# Altium schematic sheet BMS-S04-V00-Microcontroller.SchDoc: Microcontroller
size A3; DrawnBy: Zoe Goodward; DocumentNumber: 2; Revision: 01; SheetNumber: 2; SheetTotal: 10; Version: 01; Project: Battery Managment System 2020; PageSetup: Record=PageOptions|CenterHorizontal=True|CenterVertical=True|PrintScale=0.97|XCorrection=1.00|YCorrection=1.00|PrintKind=0|BorderSize=5000000|LeftOffset=0|BottomOffset=0|Orientation=2|PaperLength=1000|PaperWidth=1000|Scale=100|PaperSource=7|PrintQuality=-4|MediaType=1|DitherType=10|PaperKind=A4|PrintScaleMode=1
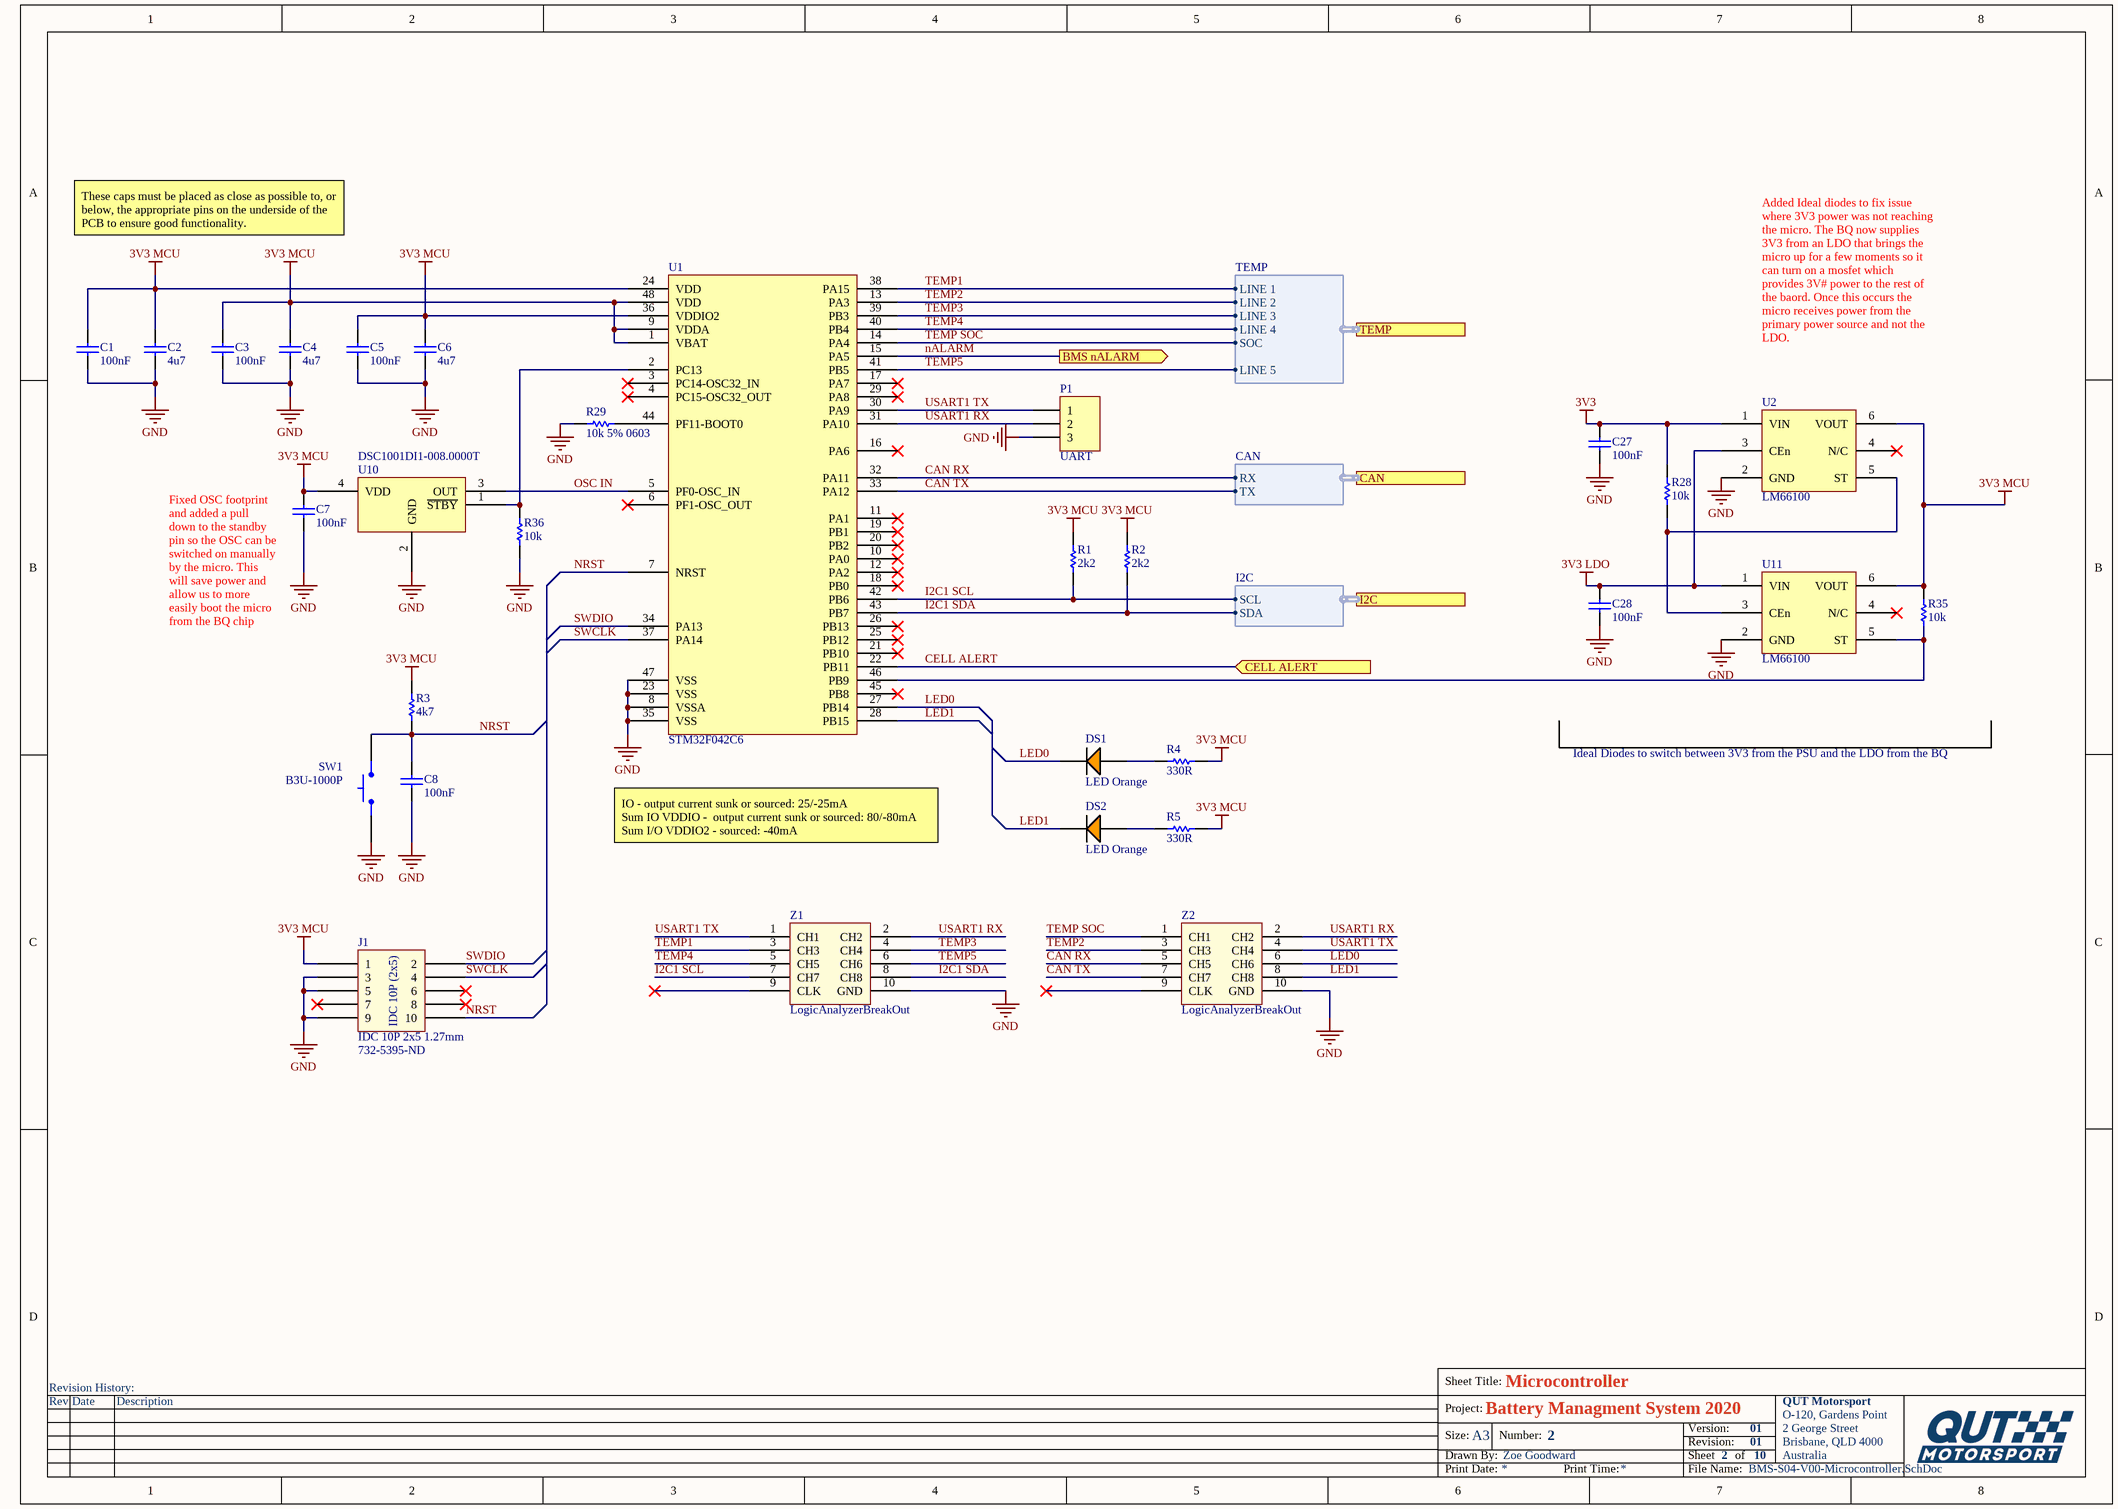
[diagram p0: BMS-S04-V00-Microcontroller.SchDoc]

## Parts
C1  100nF  [Cap_Ceramic_0603]
C2  4u7  [Cap_Ceramic_0603]
C3  100nF  [Cap_Ceramic_0603]
C4  4u7  [Cap_Ceramic_0603]
C5  100nF  [Cap_Ceramic_0603]
C6  4u7  [Cap_Ceramic_0603]
C7  100nF  [Cap_Ceramic_0603]
C8  100nF  [Cap_Ceramic_0603]
C27  100nF  [Cap_Ceramic_0603]
C28  100nF  [Cap_Ceramic_0603]
DS1  LED Orange  [LED ORANGE 0603]
DS2  LED Orange  [LED ORANGE 0603]
J1  IDC 10P 2x5 1.27mm  [IDC 1.27MM 10P]
P1  UART  [HDR1X3]
R1  2k2  [Res_ThinFilm_0603]
R2  2k2  [Res_ThinFilm_0603]
R3  4k7  [Res_ThinFilm_0603]
R4  330R  [Res_ThinFilm_0603]
R5  330R  [Res_ThinFilm_0603]
R28  10k  [Res_ThinFilm_0603]
R29  10k 5% 0603  [Res_ThinFilm_0603]
R35  10k  [Res_ThinFilm_0603]
R36  10k  [Res_ThinFilm_0603]
SW1  B3U-1000P  [BTN B3U-1000P]
U1  STM32F042C6  [STM32F042C6]
U2  LM66100  [LM66100]
U10  DSC1001DI1-008.0000T  [DSC1001DI1-008.0000TCT-ND]
U11  LM66100  [LM66100]
Z1  LogicAnalyzerBreakOut  [LogicAnalyzer]
Z2  LogicAnalyzerBreakOut  [LogicAnalyzer]

## Ports
BMS nALARM (out), CAN (harness CAN), CELL ALERT (in), I2C (harness I2C), TEMP (harness TEMP)

## Harnesses
CAN: RX, TX
TEMP: LINE 1, LINE 2, LINE 3, LINE 4, LINE 5, SOC
I2C: SCL, SDA

## Nets
3V3: C27.2 R28.2 U2.1(VIN)
3V3 LDO: C28.2 U2.3(CEn) U11.1(VIN)
3V3 MCU: C1.2 C2.2 C3.2 C4.2 C5.2 C6.2 C7.2 J1.1 R1.2 R2.2 R3.2 R4.2 R5.2 R35.2 U1.1(VBAT) U1.9(VDDA) U1.24(VDD) U1.36(VDDIO2) U1.48(VDD) U2.6(VOUT) U10.4(VDD) U11.6(VOUT)
GND: C1.1 C2.1 C3.1 C4.1 C5.1 C6.1 C7.1 C8.1 C27.1 C28.1 J1.3 J1.5 J1.9 P1.3 R29.1 R36.1 SW1.1 U1.8(VSSA) U1.23(VSS) U1.35(VSS) U1.47(VSS) U2.2(GND) U10.2(GND) U11.2(GND) Z1.10(GND) Z2.10(GND)
CAN RX: U1.32(PA11) Z2.5(CH5) ; port CAN.RX
CAN TX: U1.33(PA12) Z2.7(CH7) ; port CAN.TX
CELL ALERT: U1.22(PB11) ; port CELL ALERT
I2C1 SCL: R1.1 U1.42(PB6) Z1.7(CH7) ; port I2C.SCL
I2C1 SDA: R2.1 U1.43(PB7) Z1.8(CH8) ; port I2C.SDA
LED0: DS1.2(C) U1.27(PB14) Z2.6(CH6)
LED1: DS2.2(C) U1.28(PB15) Z2.8(CH8)
nALARM: U1.15(PA5) ; port BMS nALARM
NRST: C8.2 J1.10 R3.1 SW1.2 U1.7(NRST)
OSC IN: U1.5(PF0-OSC_IN) U10.3(OUT)
SWCLK: J1.4 U1.37(PA14)
SWDIO: J1.2 U1.34(PA13)
TEMP1: U1.38(PA15) Z1.3(CH3) ; port TEMP.LINE 1
TEMP2: U1.13(PA3) Z2.3(CH3) ; port TEMP.LINE 2
TEMP3: U1.39(PB3) Z1.4(CH4) ; port TEMP.LINE 3
TEMP4: U1.40(PB4) Z1.5(CH5) ; port TEMP.LINE 4
TEMP5: U1.41(PB5) Z1.6(CH6) ; port TEMP.LINE 5
TEMP SOC: U1.14(PA4) Z2.1(CH1) ; port TEMP.SOC
USART1 RX: P1.2 U1.31(PA10) Z1.2(CH2) Z2.2(CH2)
USART1 TX: P1.1 U1.30(PA9) Z1.1(CH1) Z2.4(CH4)
NetDS1_1: DS1.1(A) R4.1
NetDS2_1: DS2.1(A) R5.1
NetR28_1: R28.1 U2.5(ST) U11.3(CEn)
NetR29_2: R29.2 U1.44(PF11-BOOT0)
NetR35_1: R35.1 U1.46(PB9) U11.5(ST)
NetR36_2: R36.2 U1.2(PC13) U10.1(~{STBY})

Not connected (* = marked no-connect by the designer): J1 6* 7* 8*; U1 3(PC14-OSC32_IN)* 4(PC15-OSC32_OUT)* 6(PF1-OSC_OUT)* 10(PA0)* 11(PA1)* 12(PA2)* 16(PA6)* 17(PA7)* 18(PB0)* 19(PB1)* 20(PB2)* 21(PB10)* 25(PB12)* 26(PB13)* 29(PA8)* 45(PB8)*; U2 4(N/C)*; U11 4(N/C)*; Z1 9(CLK)*; Z2 9(CLK)*

## Notes on the sheet
- These caps must be placed as close as possible to, or below, the appropriate pins on the underside of the PCB to ensure good functionality.
- Added Ideal diodes to fix issue where 3V3 power was not reaching the micro. The BQ now supplies 3V3 from an LDO that brings the micro up for a few moments so it can turn on a mosfet which provides 3V# power to the rest of the baord. Once this occurs the micro receives power from the primary power source and not the LDO.
- (near C7) Fixed OSC footprint and added a pull down to the standby pin so the OSC can be switched on manually by the micro. This will save power and allow us to more easily boot the micro from the BQ chip
- Ideal Diodes to switch between 3V3 from the PSU and the LDO from the BQ
- IO - output current sunk or sourced: 25/-25mA
  Sum IO VDDIO -  output current sunk or sourced: 80/-80mA
  Sum I/O VDDIO2 - sourced: -40mA
- (near J1) 732-5395-ND
- Revision History:
- Sheet Title:
- Rev
- Date
- Description
- Project:
- Size:
- Drawn By:
- A3
- Number:
- Revision:
- Sheet
- Version:
- of
- QUT Motorsport
- O-120, Gardens Point
- 2 George Street
- Brisbane, QLD 4000
- Australia
- Print Date:
- Print Time:
- File Name:
- (in symbol IDC 10P 2x5 1.27mm) IDC 10P (2x5)

## Library data of the parts
C1 C3 C5 C7 C8 C27 C28 = 100nF 50V 5% X7R 0603: Capacitor, Ceramic, SMD, 100nF, 50V, 5%, X7R, 0603
C2 C4 C6 = 4u7 50V 5% X7R 0603: Capacitor, Ceramic, SMD, 4u7, 50V, 5%, X7R, 0603
DS1 DS2 = LED ORANGE 0603
P1 = Header 3: Header, 3-Pin; LatestRevisionDate: 17-Jul-2002; LatestRevisionNote: Re-released for DXP Platform.; Publisher: Altium Limited
R1 R2 = 2k2 5% 0603: Resistor, SMD, 2k2, 0.1W, 5%, 0603
R3 = 4k7 5% 0603: Resistor, SMD, 4k7, 0.1W, 5%, 0603
R4 R5 = 330R 5% 0603: Resistor, SMD, 330R, 0.1W, 5%, 0603
R28 R35 = 10k 1% 0603: Resistor, SMD, 10k, 0.1W, 1%, 0603
R29 R36 = 10k 5% 0603: Resistor, SMD, 10k, 0.1W, 5%, 0603
SW1 = BTN B3U-1000P: Omron B3U-1000P Ultra Miniture Switch; ComponentLink1Description: LCSC; ComponentLink1URL: https://lcsc.com/product-detail/Tactile-Switches_BRIGHT-TSA063G50-250_C294565.html
U1 = STM32042C6: ARM® Cortex®-M0 STM32F0 Microcontroller IC 32-Bit 48MHz 32KB (32K x 8) FLASH 48-LQFP (7x7); ComponentLink1Description: Digikey; ComponentLink1URL: https://www.digikey.com.au/product-detail/en/stmicroelectronics/STM32F042C6T6TR/497-19319-1-ND/10063344; ComponentLink2Description: Datasheet; ComponentLink2URL: https://www.st.com/resource/en/datasheet/stm32f042k6.pdf
U2 U11 = LM66100: Diode, SMD, 5.5V, 1.5A, SC-70; Manufacturer: ON Semiconductor / Fairchild; Manufacturer Part Number: 1N914BWS; Average Rectified Current: 150mA; Element Configuration: Single; Forward Voltage: 1V; Max Repetitive Reverse Voltage (Vrrm): 75V; Max Reverse Leakage Current: 5uA; Power Dissipation: 200mW; Recovery Time: 4ns; Max Forward Surge Current (Ifsm): 4A; Parameter 1: *; Weight: 0.0276g; Category: Rectifier Diodes; Contact Plating: Tin,Matte; Forward Current: 150mA; Lead Free: Lead Free; Max Operating Temperature: 150°C; Max Reverse Voltage (DC): 75V; Min Operating Temperature: -55°C; Mount: Surface Mount; Number of Pins: 2; Package Quantity: 1; Packaging: Tape and Reel; Peak Reverse Current: 5uA; Radiation Hardening: No; REACH SVHC: No SVHC; Reverse Recovery Time: 4ns; Height: 1mm; Length: 1.8mm; Reverse Voltage: 75V; Width: 1.35mm
U10 = DSC1001DI1-008.0000T: 8MHz XO (Standard) CMOS Oscillator 1.8 ~ 3.3V Standby (Power Down) 4-SMD, No Lead
Z1 Z2 = LogicAnalyer